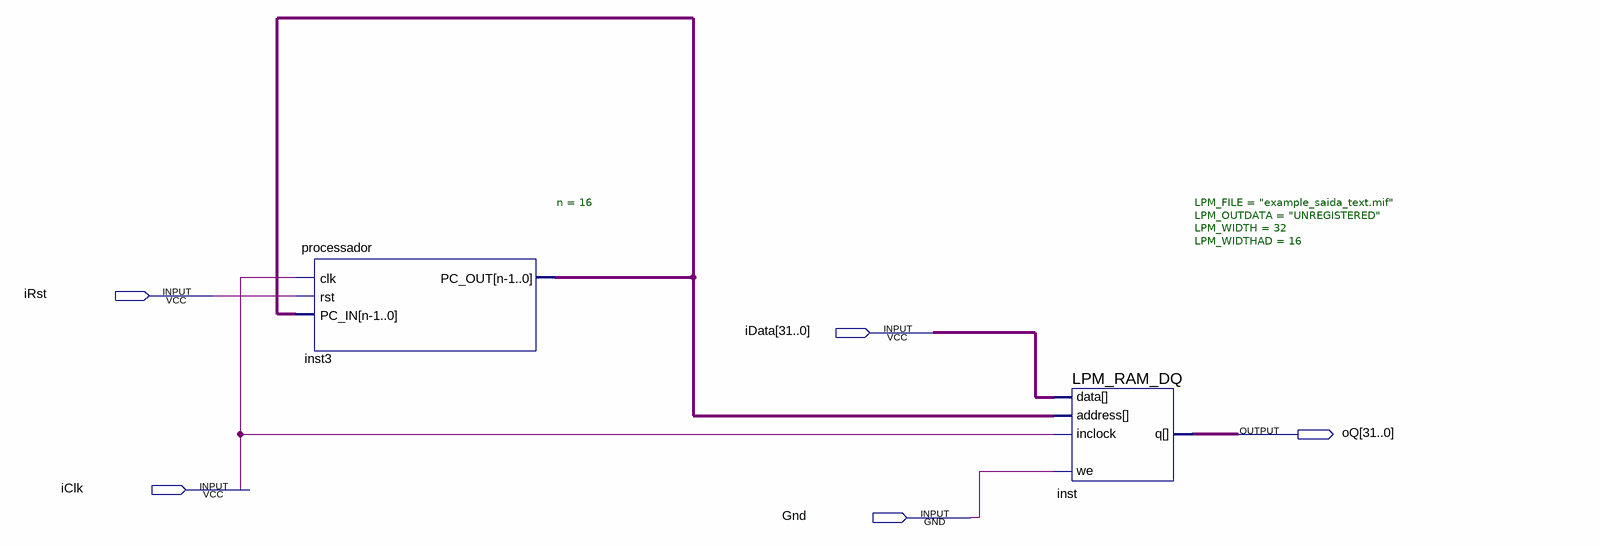
[diagram p0: schematic sheet]
// Quartus schematic lab2.bdf as structural Verilog: 2 symbols, 5 pins
module lab2 (
  input  iRst,
  input  [31:0] iData,
  input  iClk,
  input  Gnd,
  output [31:0] oQ
);

  wire [15:0] inst3_pc_out;

  processador #(.n(16)) inst3 (.clk(iClk), .rst(iRst), .PC_IN(inst3_pc_out), .PC_OUT(inst3_pc_out));
  LPM_RAM_DQ #(.LPM_FILE("example_saida_text.mif"), .LPM_OUTDATA("UNREGISTERED"), .LPM_WIDTH(32), .LPM_WIDTHAD(16)) inst (
    .address(inst3_pc_out), .data(iData), .inclock(iClk), .we(Gnd), .q(oQ));
endmodule
